# Altium schematic sheet JY901.SchDoc
size A4
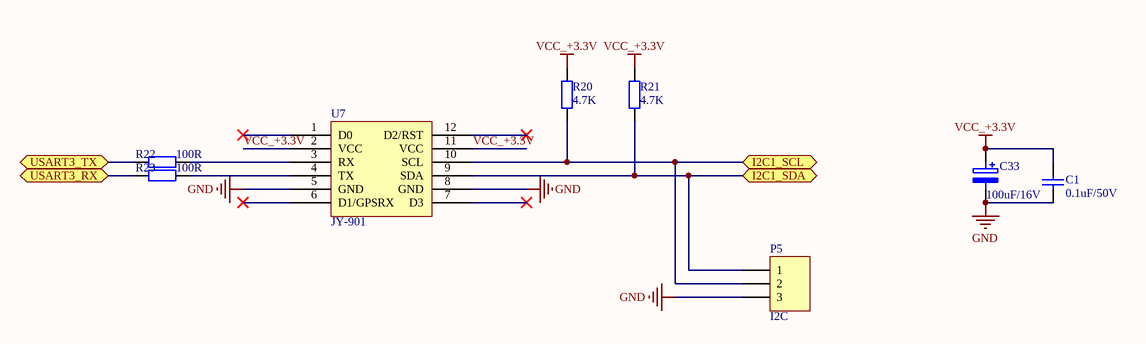
[diagram p0: JY901.SchDoc]

## Parts
C1  0.1uF/50V  [0603C]
C33  100uF/16V  [1206C]
P5  I2C  [XH254-3P]
R20  4.7K  [0603R]
R21  4.7K  [0603R]
R22  100R  [0603R]
R23  100R  [0603R]
U7  JY-901  [JY-901]

## Ports
I2C1_SCL, I2C1_SDA, USART3_RX (bidir), USART3_TX (bidir)

## Nets
GND: C1.1 C33.2 P5.3 U7.5(GND) U7.8(GND)
VCC_+3.3V: C1.2 C33.1 R20.1 R21.1 U7.2(VCC) U7.11(VCC)
I2C1_SCL: P5.2 R20.2 U7.10(SCL) ; port I2C1_SCL
I2C1_SDA: P5.1 R21.2 U7.9(SDA) ; port I2C1_SDA
USART3_RX: R23.1 ; port USART3_RX
USART3_TX: R22.1 ; port USART3_TX
NetR22_2: R22.2 U7.3(RX)
NetR23_2: R23.2 U7.4(TX)

Not connected (* = marked no-connect by the designer): U7 1(D0)* 6(D1/GPSRX)* 7(D3)* 12(D2/RST)*

## Library data of the parts
C1 = Cap: Capacitor; Value: 104; Published: 8-Jun-2000; LatestRevisionDate: 17-Jul-2002; LatestRevisionNote: Re-released for DXP Platform.; Publisher: Altium Limited
C33 = EC: Electrolytic Capacitor; 钽?: *
P5 = Header 3H: Header, 3-Pin, Right Angle; LatestRevisionDate: 17-Jul-2002; LatestRevisionNote: Re-released for DXP Platform.; Publisher: Altium Limited
R20-R23 = 0603R
U7 = JY-901: 君悦智控高精度9轴传感器